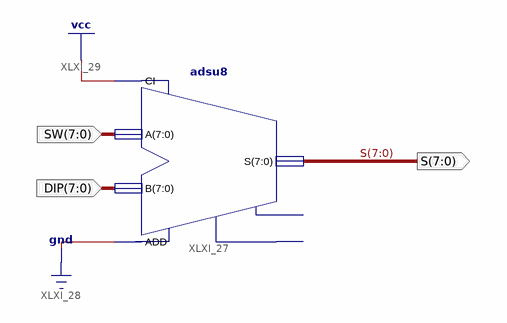
[diagram p0: schematic sheet 1]
// Xilinx ISE schematic SUB.sch (spartan6) as structural Verilog: 1 symbols, 3 ports
module SUB (
  input  [7:0] SW,
  input  [7:0] DIP,
  output [7:0] S
);

  adsu8 XLXI_27 (.A(SW), .ADD(1'b0), .B(DIP), .CI(1'b1), .S(S));  // open: CO, OFL
endmodule
